# EAGLE design usb (EAGLE 6.6.0)
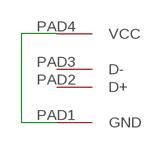
[diagram p0: schematic, sheet 1]

## Parts
U$1  MALE-USB  [USBMALE]

## Nets
N$1: U$1.PAD1(GND) U$1.PAD4(VCC)
Unconnected: U$1.PAD2(D+) U$1.PAD3(D-)

## Library data of the parts
U$1 = usb:MALE-USB

## Board
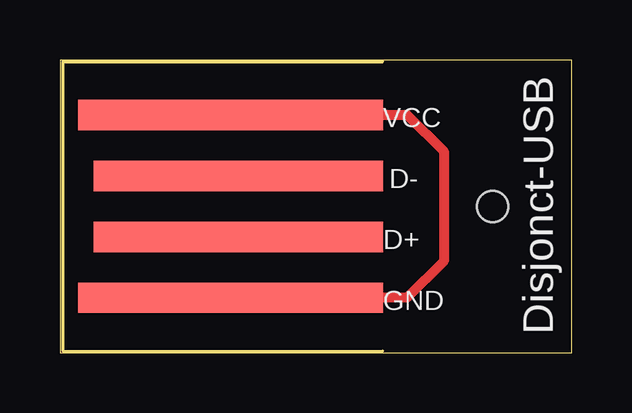
[diagram p1: board, top side]

Size 21.34 x 12.19 mm. Coordinates in mm from the lower left corner, seen from the top.
Outline: 0,0 21.34,0 21.34,12.19 0,12.19 0,0
Copper layers (1*16): Top 0.035mm / dielectric 1.5mm / Bottom 0.035mm
Design rules "default": minimum track width 10mil, minimum drill 24mil, track to track 8mil, track to pad 8mil, pad to pad 8mil, via to via 8mil, smd to smd 8mil, copper to edge 40mil, drill to drill 8mil, minimum pad ring 10mil, minimum via ring 8mil, stop-mask expansion 4mil, vias tented up to drill 0mil, thermal gap 10mil
Holes 1.3 mm at 18.03,6.1

### Footprints (pad centres in the part's own frame; a part is rotated, then mirrored left to right if it is on the bottom)
USBMALE = smd 12.7 x 1.27: PAD1 6.35,3.81; PAD4 6.35,-3.81 | smd 12.065 x 1.27: PAD2 6.032,1.27; PAD3 6.032,-1.27

### Placement (x,y rotation side)
U$1  13.46,6.1 180 top

### Tracks (layer width: path | path; a pad name or v marks a point on that pad's centre or on a via)
N$1
  Top 0.406: U$1.PAD4 14.48,9.91 16,8.38 16,3.81 14.48,2.29 U$1.PAD1

### Text on the board
tNames: VCC | D- | D+ | GND | Disjonct-USB